# EasyEDA schematic SCH_Automatic-Irrigation-System-PBL_2025-08-29.json
TITLE: Sheet_1; REV: 1.0; Date: 2025-08-27; Sheet: 1/1; Drawn By: falhan; Company: Your Company
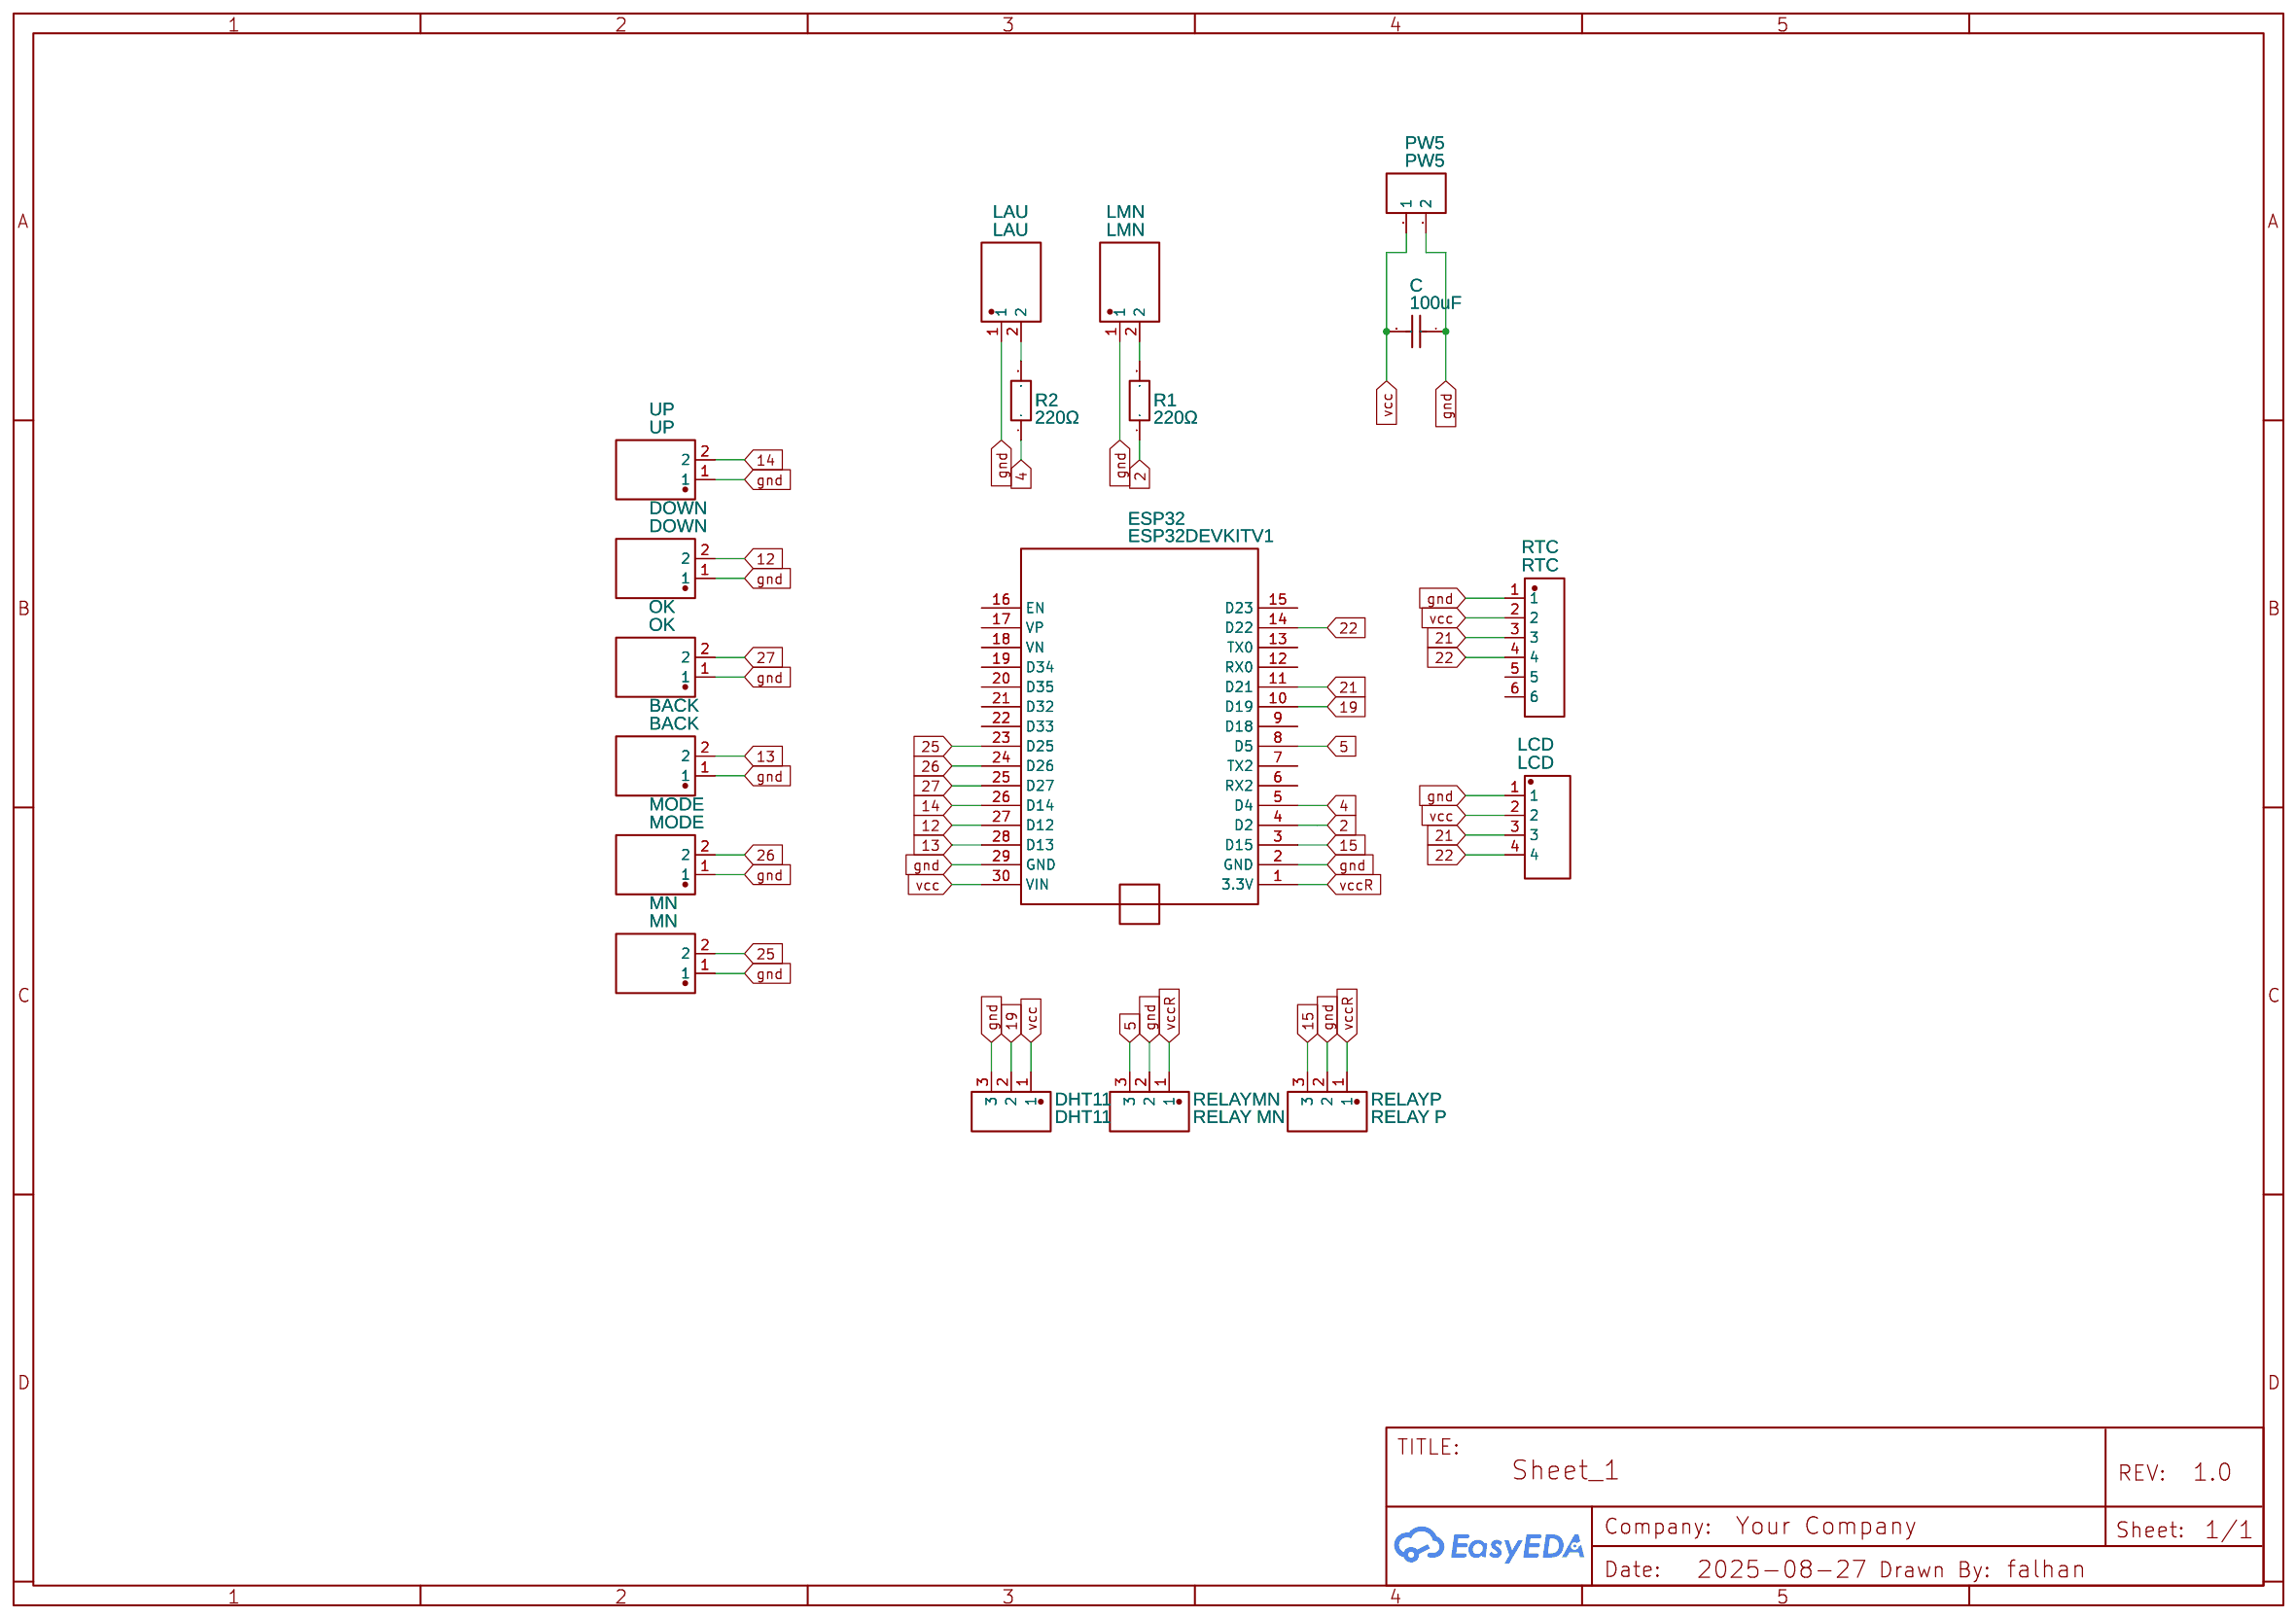
[diagram p0: schematic sheet]

## Parts
BACK  BACK  [CONN-TH_2P-P2.54_2501S-2P]
C  100uF  [CAPACITOR, 5MM PIN CAPACITOR]
DHT11  DHT11  [CONN-TH_3P-P2.54_2501S-3P]
DOWN  DOWN  [CONN-TH_2P-P2.54_2501S-2P]
ESP32  ESP32DEVKITV1  [ESP32DEVKITV1]
LAU  LAU  [CONN-TH_2P-P2.54_2501S-2P]
LCD  LCD  [CONN-TH_4P-P2.54_2501S-4P]
LMN  LMN  [CONN-TH_2P-P2.54_2501S-2P]
MN  MN  [CONN-TH_2P-P2.54_2501S-2P]
MODE  MODE  [CONN-TH_2P-P2.54_2501S-2P]
OK  OK  [CONN-TH_2P-P2.54_2501S-2P]
PW5  PW5  [CONN-TH_2P-P5.00]
R1  220Ω  [RES-TH_BD2.4-L6.3-P10.30-D0.6]
R2  220Ω  [RES-TH_BD2.4-L6.3-P10.30-D0.6]
RELAYMN  RELAY MN  [HDR-TH_3P-P2.54-V-F-3]
RELAYP  RELAY P  [HDR-TH_3P-P2.54-V-F-3]
RTC  RTC  [HDR-TH_6P-P2.54-V-F]
UP  UP  [CONN-TH_2P-P2.54_2501S-2P]

## Library data of the parts
BACK DOWN LAU LMN MN MODE OK UP = 2501S-2P_C168996: Contributor: 立创EDA官方封装库; Supplier: LCSC; Supplier Part: C168996; Manufacturer: Ckmtw(灿科盟); Manufacturer Part: W-2501S02P-K200; JLCPCB Part Class: Extended Part
C = 1nF ±20% 250V/AC Y2Capacitor: Supplier: LCSC; Manufacturer: ReliaPro; Supplier Part: C52215; Package Display: No
DHT11 = ZX-XH2.54-3PZZ: Contributor: lcsc; Supplier: LCSC; Supplier Part: C7429633; Manufacturer: Megastar(兆星); JLCPCB Part Class: Extended Part
ESP32 = ESP32DEVKITV1: Contributor: sreejeesh
LCD = 2501S-4P_C125328: Contributor: 立创EDA官方封装库; Supplier: LCSC; Manufacturer: Ckmtw(灿科盟); Manufacturer Part: W-2501S04P-K000; Supplier Part: C125328; JLCPCB Part Class: Extended Part
PW5 = CONN-TH_2P-P5.00: Supplier: LCSC; Contributor: LCEDA_Lib
R1 R2 = RN 1/4W 10K F T/B A1: Contributor: LCSC; Supplier: LCSC; Supplier Part: C410695; Manufacturer: Tyohm(幸亚电阻); Manufacturer Part: RN1/4W10KFT/BA1; JLCPCB Part Class: Extended Part
RELAYMN RELAYP = ZX-XH2.54-3PZZ: Contributor: lcsc; Supplier: LCSC; Supplier Part: C7429633; Manufacturer: Megastar(兆星); JLCPCB Part Class: Extended Part; Package Display: No
RTC = Header-Female-2.54_1x6: Supplier: LCSC; Manufacturer: BOOMELE(博穆精密); Manufacturer Part: 2.54-1*6P母; Supplier Part: C40877; JLCPCB Part Class: Extended Part

## Nets
gnd: BACK.1 C.1 DHT11.3 DOWN.1 ESP32.2(GND) ESP32.29(GND) LAU.1 LCD.1 LMN.1 MN.1 MODE.1 OK.1 PW5.2 RELAYMN.2 RELAYP.2 RTC.1 UP.1
vcc: C.2 DHT11.1 ESP32.30(VIN) LCD.2 PW5.1 RTC.2
vccR: ESP32.1(3.3V) RELAYMN.1 RELAYP.1
2: ESP32.4(D2) R1.1
4: ESP32.5(D4) R2.1
5: ESP32.8(D5) RELAYMN.3
12: DOWN.2 ESP32.27(D12)
13: BACK.2 ESP32.28(D13)
14: ESP32.26(D14) UP.2
15: ESP32.3(D15) RELAYP.3
19: DHT11.2 ESP32.10(D19)
21: ESP32.11(D21) LCD.3 RTC.3
22: ESP32.14(D22) LCD.4 RTC.4
25: ESP32.23(D25) MN.2
26: ESP32.24(D26) MODE.2
27: ESP32.25(D27) OK.2
Net-(LAU-2): LAU.2 R2.2
Net-(LMN-2): LMN.2 R1.2

Not connected (* = marked no-connect by the designer): ESP32 6(RX2) 7(TX2) 9(D18) 12(RX0) 13(TX0) 15(D23) 16(EN) 17(VP) 18(VN) 19(D34) 20(D35) 21(D32) 22(D33); RTC 5 6
